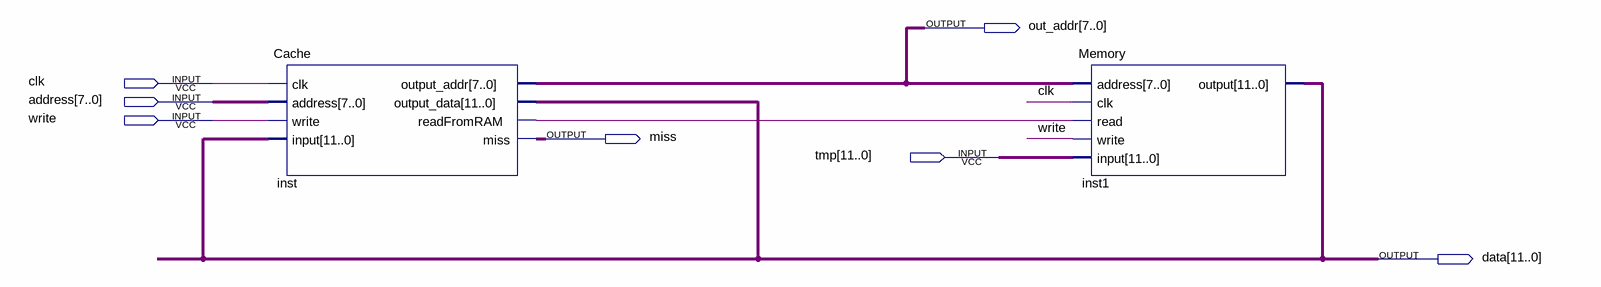
[diagram p0: schematic sheet]
// Quartus schematic Block1.bdf as structural Verilog: 2 symbols, 7 pins
module Block1 (
  input  clk,
  input  [7:0] address,
  input  write,
  input  [11:0] tmp,
  output [7:0] out_addr,
  output miss,
  output [11:0] data
);

  wire inst_readfromram;

  Cache inst (
    .clk(clk), .address(address), .write(write), .\input (data), .output_addr(out_addr), .output_data(data),
    .readFromRAM(inst_readfromram), .miss(miss));
  Memory inst1 (.address(out_addr), .clk(clk), .read(inst_readfromram), .write(write), .\input (tmp), .\output (data));
endmodule
